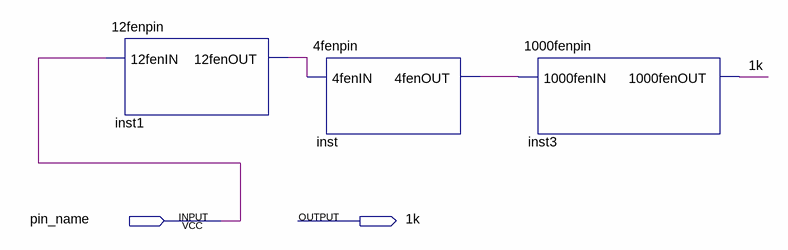
[diagram p0: schematic sheet]
// Quartus schematic 1k.bdf as structural Verilog: 3 symbols, 2 pins
module \1k  (
  input  pin_name,
  output \1k 
);

  wire inst1_12fenout, inst_4fenout;

  \12fenpin  inst1 (.\12fenIN (pin_name), .\12fenOUT (inst1_12fenout));
  \4fenpin  inst (.\4fenIN (inst1_12fenout), .\4fenOUT (inst_4fenout));
  \1000fenpin  inst3 (.\1000fenIN (inst_4fenout), .\1000fenOUT (\1k ));
endmodule
